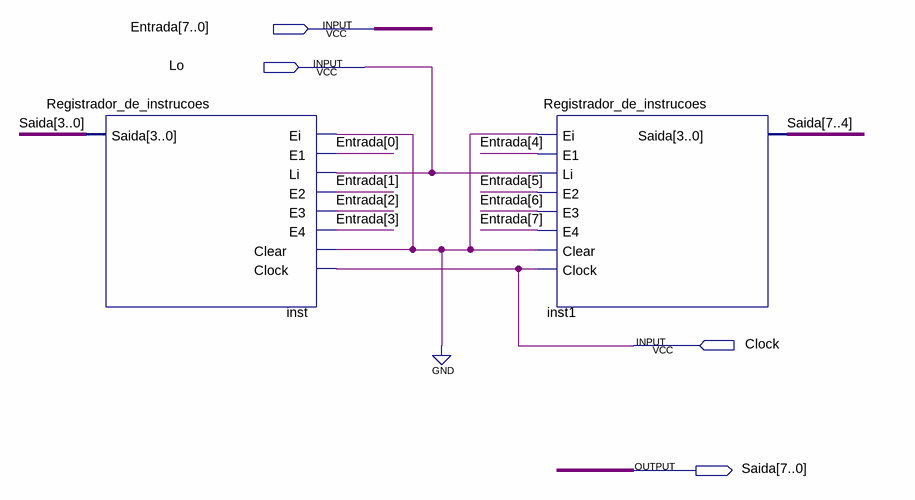
[diagram p0: schematic sheet]
// Quartus schematic Registrador_de_saida.bdf as structural Verilog: 2 symbols, 4 pins
module Registrador_de_saida (
  input  [7:0] Entrada,
  input  Lo,
  input  Clock,
  output [7:0] Saida
);

  Registrador_de_instrucoes inst (
    .Ei(1'b0), .E1(Entrada[0]), .Li(Lo), .E2(Entrada[1]), .E3(Entrada[2]), .E4(Entrada[3]), .Clear(1'b0),
    .Clock(Clock), .Saida(Saida[3:0]));
  Registrador_de_instrucoes inst1 (
    .Ei(1'b0), .E1(Entrada[4]), .Li(Lo), .E2(Entrada[5]), .E3(Entrada[6]), .E4(Entrada[7]), .Clear(1'b0),
    .Clock(Clock), .Saida(Saida[7:4]));
endmodule
